# EasyEDA schematic SCH_Knov-V3_3-sound-+DMS13A_2026-08-17.json

## Sheets
1 Platine Bouton Sound +DMS13A: TITLE: COMMANDE G1000; REV: 3.45; Date: 2026-04-25; Sheet: 1/1; Drawn By: Obbiwan; Company: My Company
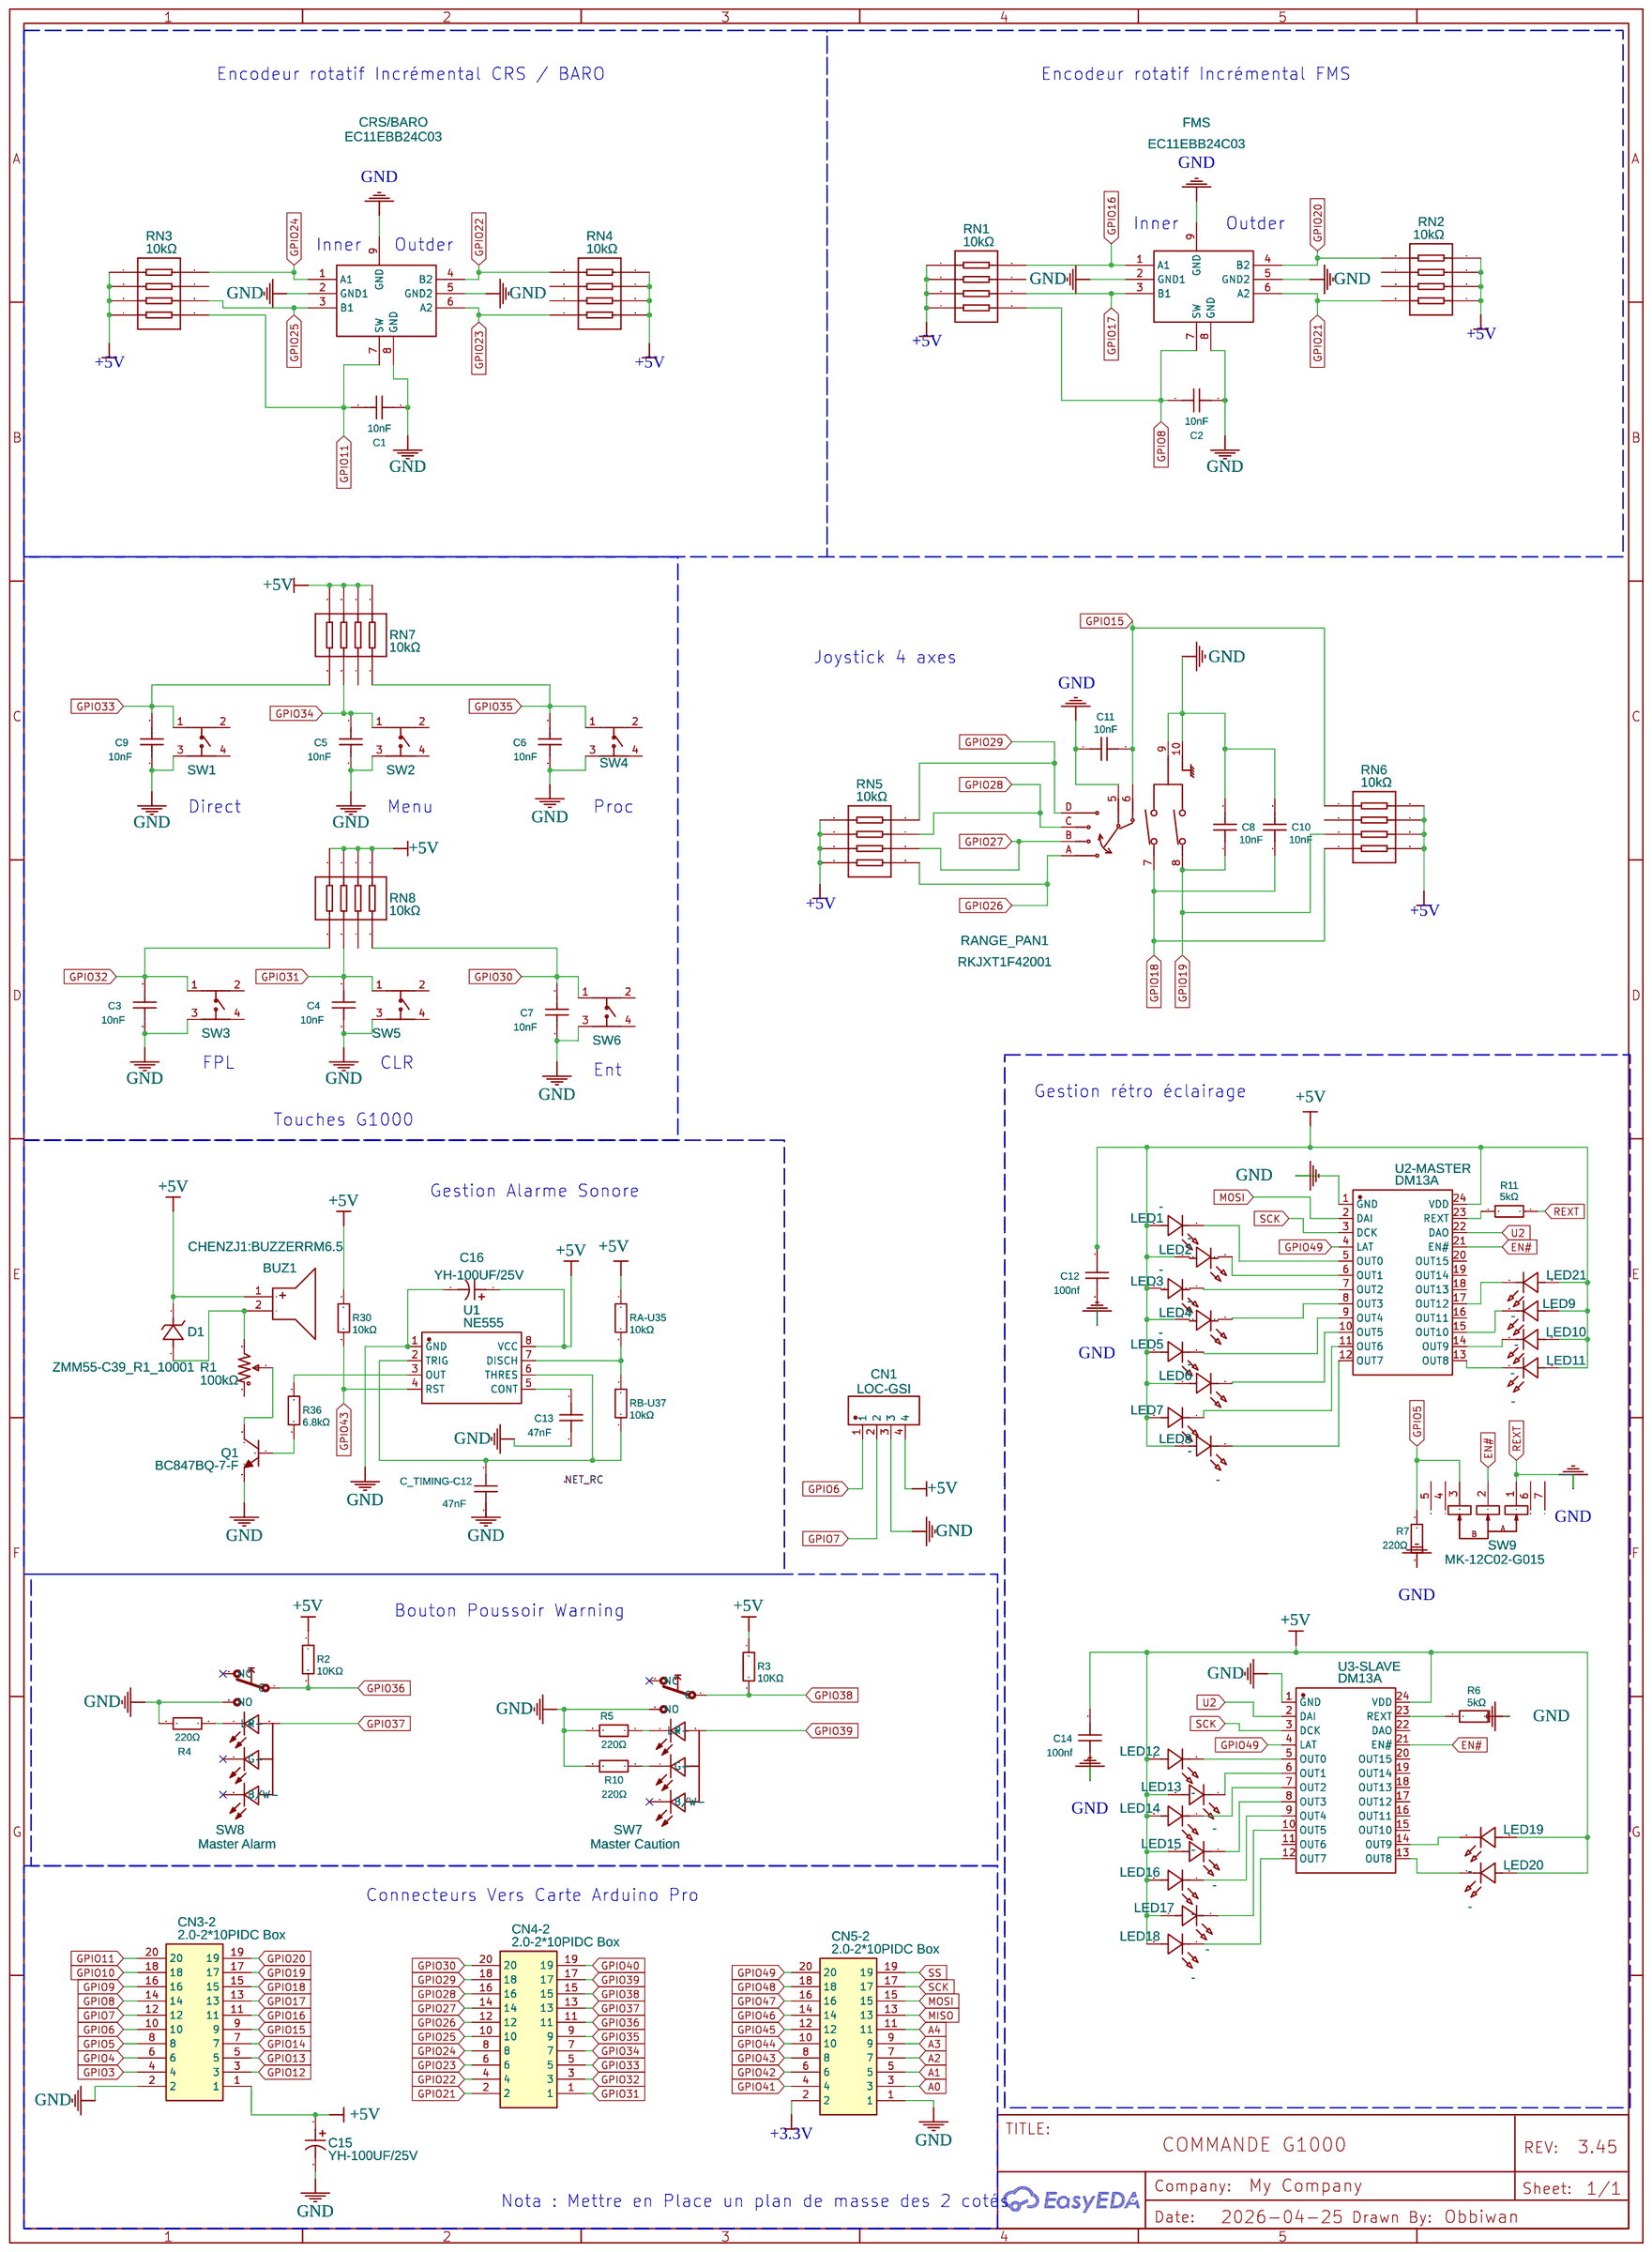
[diagram p0: Platine Bouton Sound +DMS13A]
2 Platine Arduino sound +DMS13A: TITLE: Platine G1000 - CPU; REV: 3.4; Date: 2025-11-30; Drawn By: francois.colas22; Company: Your Company
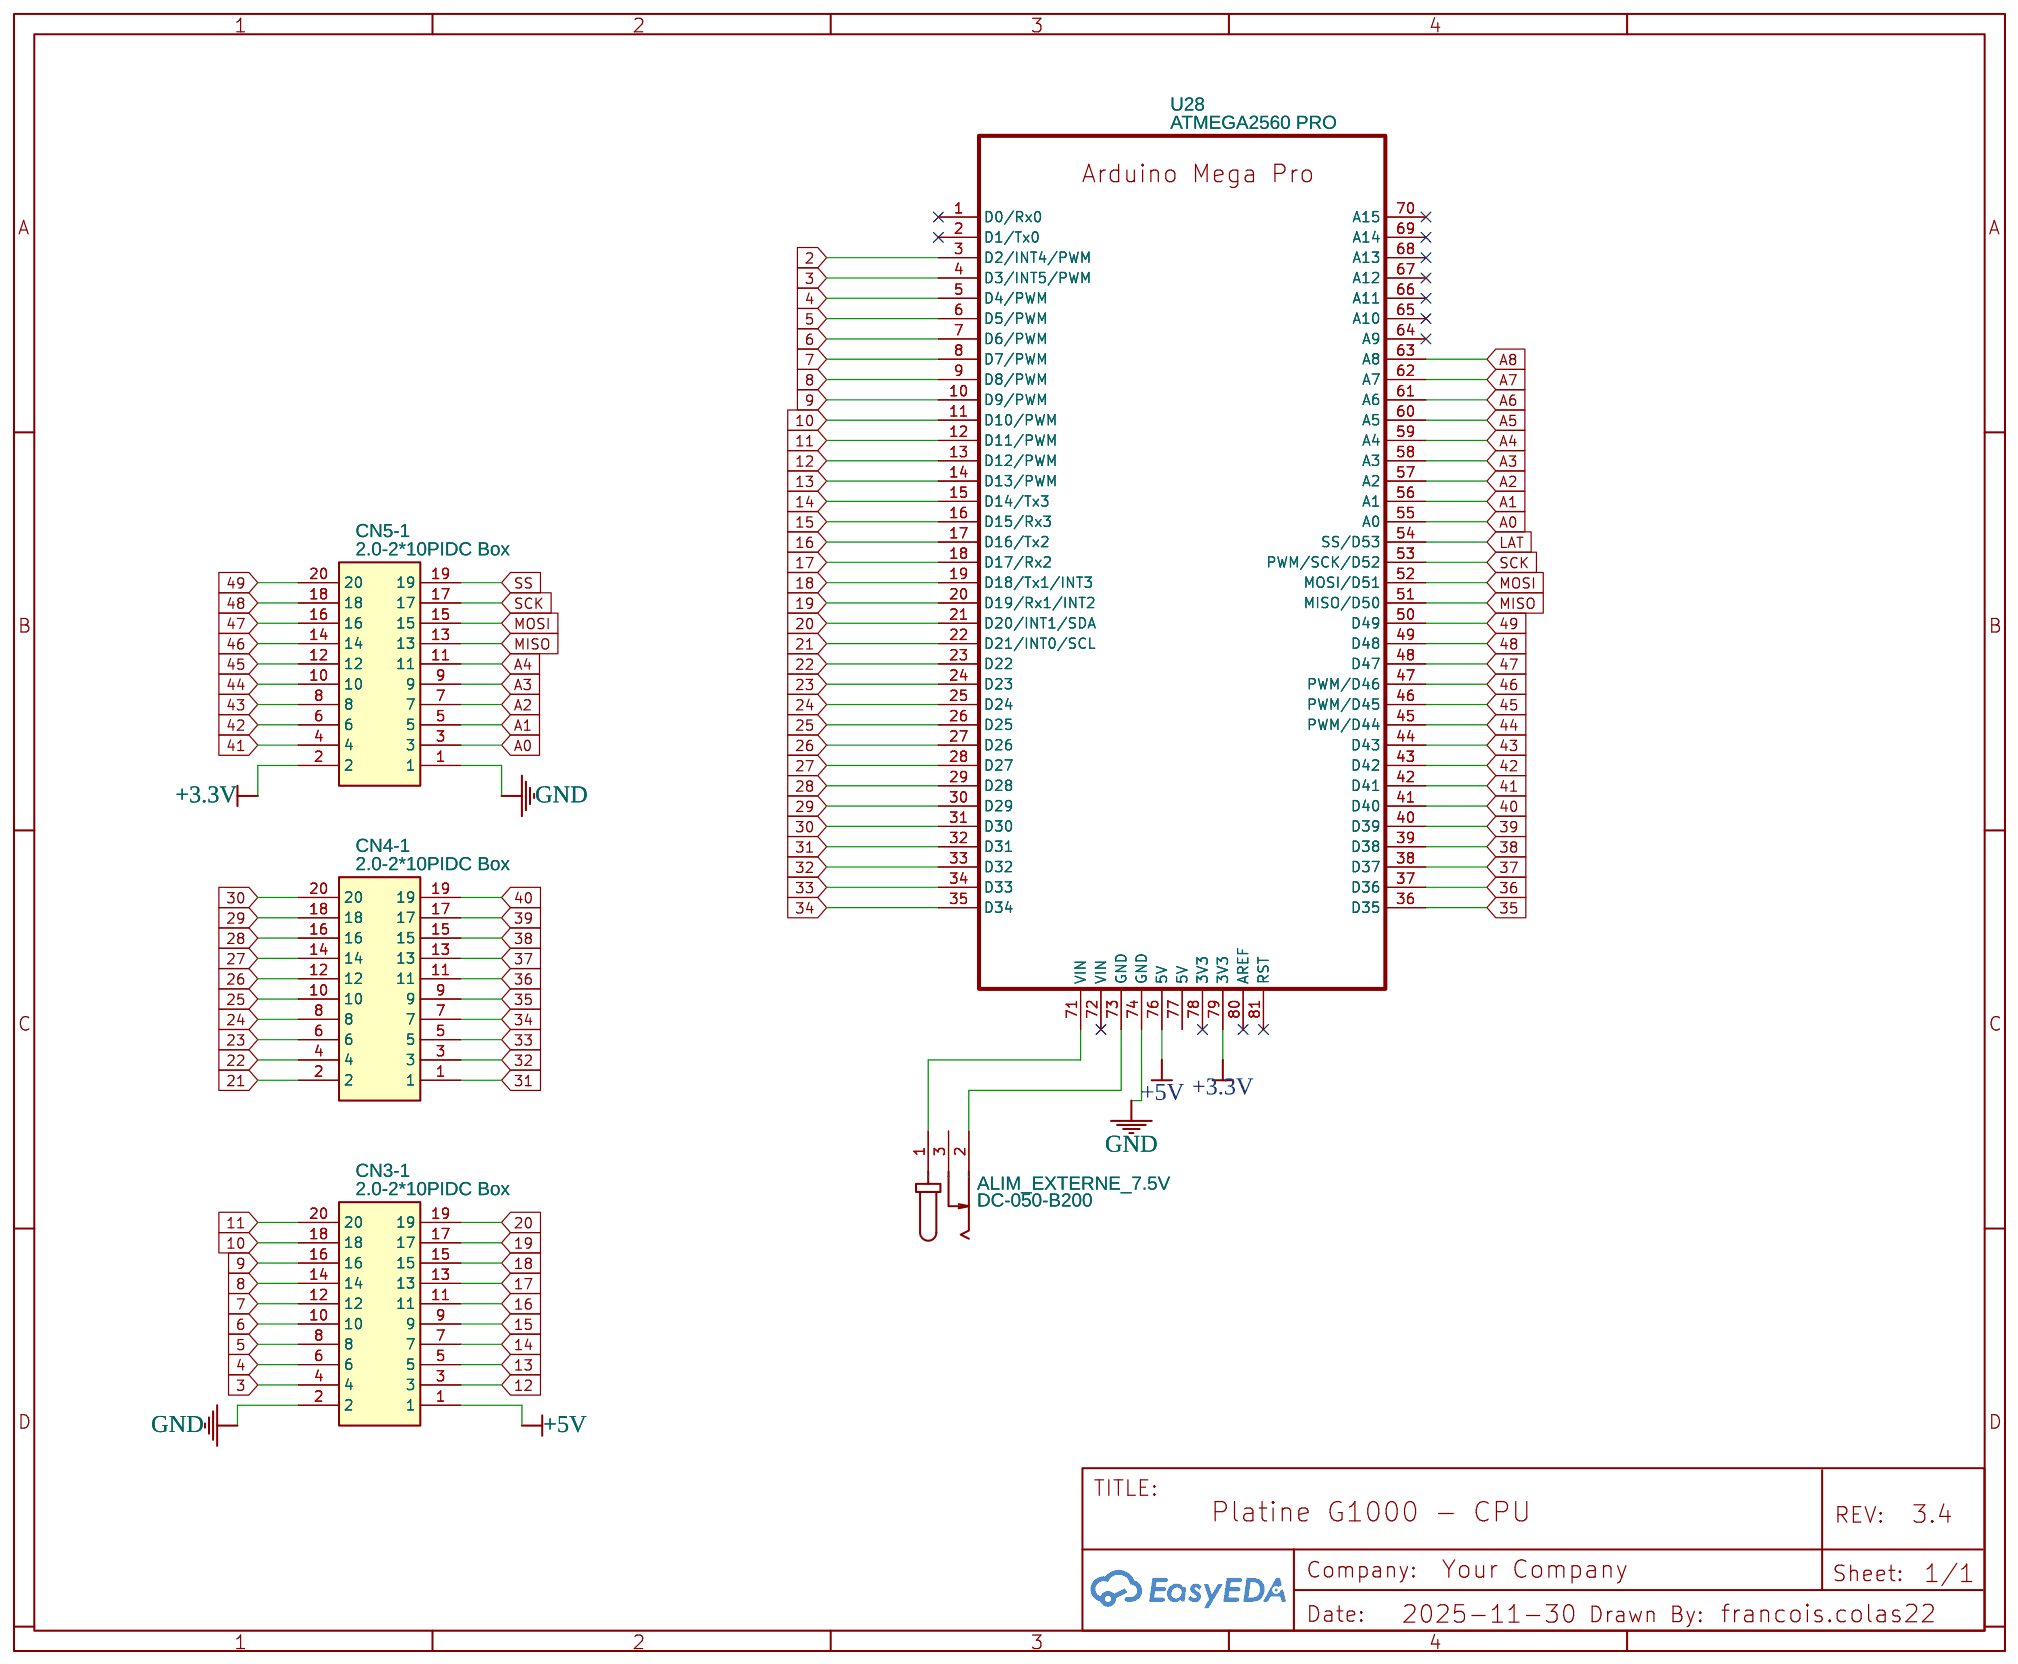
[diagram p1: Platine Arduino sound +DMS13A]
3 Platine LED: TITLE: Sheet_1; REV: 1.0; Date: 2026-05-24; Drawn By: francois.colas22; Company: Your Company
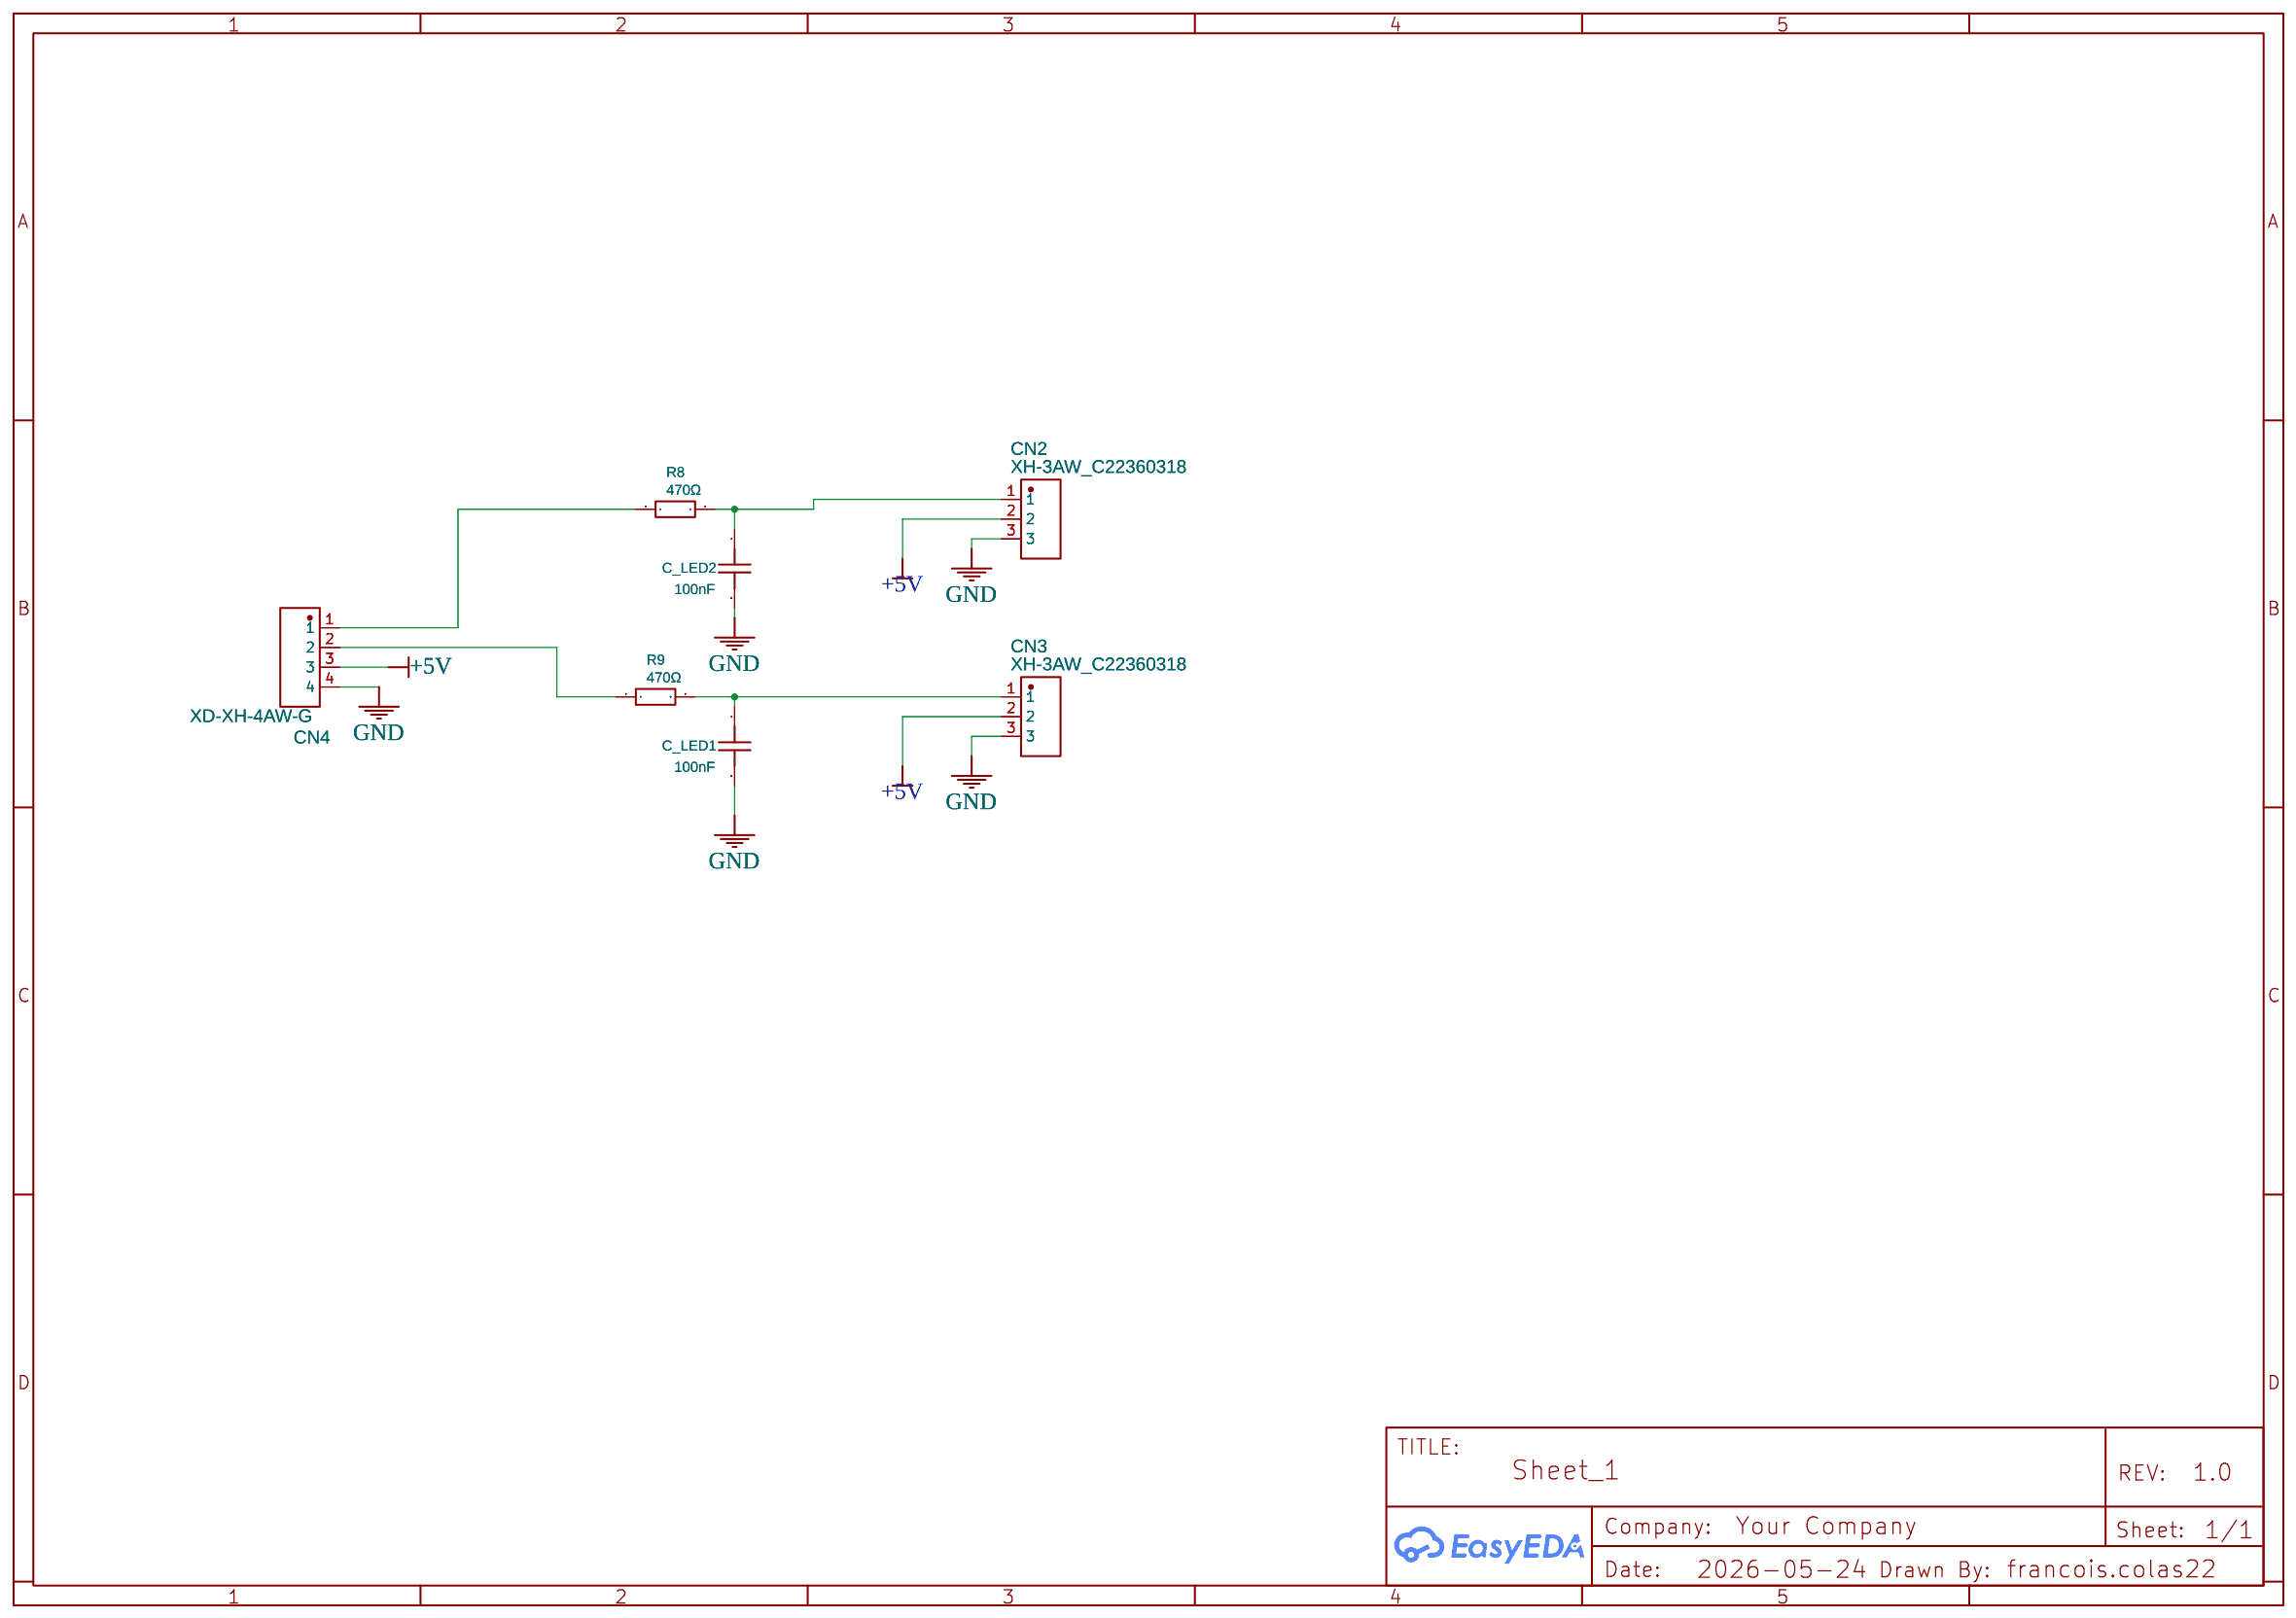
[diagram p2: Platine LED]

## Parts
sheet Platine Arduino sound +DMS13A
ALIM_EXTERNE_7.5V  DC-050-B200  [DC-IN-SMD_DC-050-B200]
CN3-1  2.0-2*10PIDC Box  [IDC-TH_2.0-2-10PIDCBOX]
CN4-1  2.0-2*10PIDC Box  [IDC-TH_2.0-2-10PIDCBOX]
CN5-1  2.0-2*10PIDC Box  [IDC-TH_2.0-2-10PIDCBOX]
U28  ATMEGA2560 PRO  [ATMEGA2560 EMBEDED]
sheet Platine Bouton Sound +DMS13A
BUZ1  CHENZJ1:BUZZERRM6.5  [BUZ-TH_BD12.0-P6.50-D0.6_SEA-1285F]
C1  10nF  [C0603]
C2  10nF  [C0603]
C3  10nF  [C0603]
C4  10nF  [C0603]
C5  10nF  [C0603]
C6  10nF  [C0603]
C7  10nF  [C0603]
C8  10nF  [C0603]
C9  10nF  [C0603]
C10  10nF  [C0603]
C11  10nF  [C0603]
C12  100nf  [C0603]
C13  47nF  [C0603]
C14  100nf  [C0603]
C15  YH-100UF/25V  [CAP-SMD_BD6.3-L6.6-W6.6-LS7.2-FD]
C16  YH-100UF/25V  [CAP-SMD_BD6.3-L6.6-W6.6-LS7.2-FD]
C_TIMING-C12  47nF  [C0603]
CN1  LOC-GSI  [CONN-TH_XD-XH-4AW-G]
CN3-2  2.0-2*10PIDC Box  [IDC-TH_2.0-2-10PIDCBOX]
CN4-2  2.0-2*10PIDC Box  [IDC-TH_2.0-2-10PIDCBOX]
CN5-2  2.0-2*10PIDC Box  [IDC-TH_2.0-2-10PIDCBOX]
CRS/BARO  EC11EBB24C03  [DUAL ENCODER W/CLICK EC11EBB24C03]
D1  ZMM55-C39_R1_10001  [LL-34_L3.5-W1.5-RD]
FMS  EC11EBB24C03  [DUAL ENCODER W/CLICK EC11EBB24C03]
LED1  -  [LED0805-RD_YELLOW]
LED2  -  [LED0805-RD_YELLOW]
LED3  -  [LED0805-RD_YELLOW]
LED4  -  [LED0805-RD_YELLOW]
LED5  -  [LED0805-RD_YELLOW]
LED6  -  [LED0805-RD_YELLOW]
LED7  -  [LED0805-RD_YELLOW]
LED8  -  [LED0805-RD_YELLOW]
LED9  -  [LED0805-RD_YELLOW]
LED10  -  [LED0805-RD_YELLOW]
LED11  -  [LED0805-RD_YELLOW]
LED12  -  [LED0805-RD_YELLOW]
LED13  -  [LED0805-RD_YELLOW]
LED14  -  [LED0805-RD_YELLOW]
LED15  -  [LED0805-RD_YELLOW]
LED16  -  [LED0805-RD_YELLOW]
LED17  -  [LED0805-RD_YELLOW]
LED18  -  [LED0805-RD_YELLOW]
LED19  -  [LED0805-RD_YELLOW]
LED20  -  [LED0805-RD_YELLOW]
LED21  -  [LED0805-RD_YELLOW]
Q1  BC847BQ-7-F  [SOT-23-3_L2.9-W1.3-P1.90-LS2.4-BR]
R1  100kΩ  [RES-ADJ-TH_3P-L7.3-W6.4-P5.00-R]
R2  10KΩ  [R0603]
R3  10KΩ  [R0603]
R4  220Ω  [R0603]
R5  220Ω  [R0603]
R6  5kΩ  [R0603]
R7  220Ω  [R0603]
R10  220Ω  [R0603]
R11  5kΩ  [R0603]
R30  10kΩ  [R0603]
R36  6.8kΩ  [R0603]
RA-U35  10kΩ  [R0603]
RANGE_PAN1  RKJXT1F42001  [SW-TH_RKJXT1F42001]
RB-U37  10kΩ  [R0603]
RN1  10kΩ  [RES-ARRAY-SMD_0603-8P-L3.2-W1.6-BL]
RN2  10kΩ  [RES-ARRAY-SMD_0603-8P-L3.2-W1.6-BL]
RN3  10kΩ  [RES-ARRAY-SMD_0603-8P-L3.2-W1.6-BL]
RN4  10kΩ  [RES-ARRAY-SMD_0603-8P-L3.2-W1.6-BL]
RN5  10kΩ  [RES-ARRAY-SMD_0603-8P-L3.2-W1.6-BL]
RN6  10kΩ  [RES-ARRAY-SMD_0603-8P-L3.2-W1.6-BL]
RN7  10kΩ  [RES-ARRAY-SMD_0603-8P-L3.2-W1.6-BL]
RN8  10kΩ  [RES-ARRAY-SMD_0603-8P-L3.2-W1.6-BL]
SW1  YTS-D001-285  [SW-TH_4P-L6.0-W6.0-P4.50-LS6.5]
SW2  YTS-D001-285  [SW-TH_4P-L6.0-W6.0-P4.50-LS6.5]
SW3  YTS-D001-285  [SW-TH_4P-L6.0-W6.0-P4.50-LS6.5]
SW4  YTS-D001-285  [SW-TH_4P-L6.0-W6.0-P4.50-LS6.5]
SW5  YTS-D001-285  [SW-TH_4P-L6.0-W6.0-P4.50-LS6.5]
SW6  YTS-D001-285  [SW-TH_4P-L6.0-W6.0-P4.50-LS6.5]
SW7  Master Caution  [PB26-13M RGB/W-LED]
SW8  Master Alarm  [PB26-13M RGB/W-LED]
SW9  MK-12C02-G015  [SW-SMD_G-SWITCH_MK-12C02-G015]
U1  NE555  [SOIC-8_L4.9-W3.9-P1.27-LS6.0-BL]
U2-MASTER  DM13A  [SOP-24_L13.0-W6.0-P1.00-LS8.0-BL]
U3-SLAVE  DM13A  [SOP-24_L13.0-W6.0-P1.00-LS8.0-BL]
sheet Platine LED
C_LED1  100nF  [C0603]
C_LED2  100nF  [C0603]
CN2  XH-3AW_C22360318  [CONN-TH_XH-3AW]
CN3  XH-3AW_C22360318  [CONN-TH_XH-3AW]
CN4  XD-XH-4AW-G  [CONN-TH_XD-XH-4AW-G]
R8  470Ω  [R0603]
R9  470Ω  [R0603]

## Library data of the parts
ALIM_EXTERNE_7.5V = DC-050-B200: Contributor: lcsc; Supplier: LCSC; Supplier Part: C720582; Manufacturer: XUNPU(讯普); JLCPCB Part Class: Extended Part
CN3-1 CN3-2 CN4-1 CN4-2 CN5-1 CN5-2 = 2.0-2*10PIDC Box: Supplier: LCSC; Manufacturer: BOOMELE; Supplier Part: C55267; JLCPCB Part Class: Extended Part; Contributor: Bijesh Manayil
U28 = ATMEGA2560 PRO: Manufacturer: RobotDyn; Manufacturer Part: MEGA-PRO-CH340G/ATmega2560; Contributor: hindsight
BUZ1 = CHENZJ1:BUZZER_12X9.5RM6.5: Contributor: LCSC; Supplier: LCSC; Supplier Part: C9900008742; Manufacturer: null; Manufacturer Part: chenzj1:Buzzer_12x9.5RM6.5; JLCPCB Part Class: Extended Part
C1-C14 C_LED1 C_LED2 C_TIMING-C12 = CT41G-0603-2X1-50V-0.01UF-K(N): Contributor: LCSC; Supplier: LCSC; Supplier Part: C136131; Manufacturer: TORCH(火炬); Manufacturer Part: CT41G-0603-2X1-50V-0.01μF-K(N); JLCPCB Part Class: Extended Part; link: https://lcsc.com/eda_search?q=C136131&%26type=1&ref=editor
C15 C16 = YH-100UF/25V-贴片电解电容: Contributor: LCSC; Supplier: LCSC; Supplier Part: C9900006374; Manufacturer Part: YH-100uF/25V-贴片电解电容; JLCPCB Part Class: Extended Part; Manufacturer: null
CN1 CN4 = XD-XH-4AW-G: Supplier: LCSC; Supplier Part: C17700963; Manufacturer: XUNDA(讯答); JLCPCB Part Class: Extended Part; Contributor: lcsc
CRS/BARO FMS = EC11EBB24C03: Contributor: Xavi Jurio; link: https://www.alps.com/prod/info/E/HTML/Encoder/Incremental/EC11/EC11EBB24C03.html
D1 = ZMM55-C39_R1_10001: Contributor: LCSC; Supplier: LCSC; Supplier Part: C391779; Manufacturer: PANJIT(强茂); JLCPCB Part Class: Extended Part
LED1-LED21 = TZ-P2-0805YTCS2-0.8T: Contributor: LCSC; Supplier: LCSC; Supplier Part: C20608785; Manufacturer: LITEON(光宝); Manufacturer Part: YLED0805Y; JLCPCB Part Class: Extended Part
Q1 = BC847BQ-7-F: Contributor: lcsc; Supplier: LCSC; Supplier Part: C2922347; Manufacturer: DIODES(美台); JLCPCB Part Class: Extended Part
R1 = RM065-204(200K): Contributor: lcsc; Supplier: LCSC; Supplier Part: C5205025; Manufacturer: BOCHEN(博晨); JLCPCB Part Class: Extended Part
R2 R30 = HPCR0603F5K60K9: Supplier: LCSC; Supplier Part: C365194; Manufacturer: RESI(开步睿思）; Manufacturer Part: SCR0603J10K; Resistance (Ohms): 10K; Contributor: LCSC; JLCPCB Part Class: Extended Part
R3 R7-R9 R36 = HPCR0603F5K60K9: Supplier: LCSC; Supplier Part: C365194; Manufacturer: RESI(开步睿思）; Manufacturer Part: SCR0603J10K; Resistance (Ohms): 10kΩ; Contributor: LCSC; JLCPCB Part Class: Extended Part
R4 R5 R10 = HPCR0603F5K60K9: Supplier: LCSC; Supplier Part: C365194; Manufacturer: RESI(开步睿思）; Contributor: LCSC; JLCPCB Part Class: Extended Part
R6 R11 = HPCR0603F5K60K9: Supplier: LCSC; Supplier Part: C365194; Manufacturer: RESI(开步睿思）; Resistance (Ohms): 36Ω; Contributor: LCSC; JLCPCB Part Class: Extended Part
RA-U35 RB-U37 = HPCR0603F5K60K9: Supplier: LCSC; Supplier Part: C365194; Manufacturer: RESI(开步睿思）; Manufacturer Part: SCR0603J10K; Contributor: LCSC; JLCPCB Part Class: Extended Part
RANGE_PAN1 = RKJXT1F42001: Supplier: LCSC; Supplier Part: C160841; Manufacturer: ALPSALPINE(阿尔卑斯阿尔派); Contributor: LCSC; JLCPCB Part Class: Extended Part
RN1-RN8 = RTA03-4D103JTP: Supplier: LCSC; Manufacturer: RALEC(旺诠); Supplier Part: C102646; JLCPCB Part Class: Extended Part
SW1-SW6 = YTS-D001-285: Contributor: LCSC; Supplier: LCSC; Supplier Part: C2910911; Manufacturer: YIYUAN(怡远); JLCPCB Part Class: Extended Part; link: https://lcsc.com/eda_search?q=C2910911&%26type=1&ref=editor
SW7 SW8 = PB26-13M RGB/W: Manufacturer: Honyone; Contributor: Tony Sloos
SW9 = MK-12C02-G015: Contributor: LCSC; Supplier: LCSC; Supplier Part: C2911519; Manufacturer: G-Switch(品赞); JLCPCB Part Class: Extended Part
U1 = NE555DR_C41431778: Supplier: LCSC; Supplier Part: C41431778; Manufacturer: TECH PUBLIC(台舟); Manufacturer Part: NE555DR; Contributor: lcsc; JLCPCB Part Class: Extended Part; Package Display: No
U2-MASTER U3-SLAVE = DM13A: Contributor: lcsc; Supplier: LCSC; Supplier Part: C9900020811; Manufacturer: null; JLCPCB Part Class: Extended Part
CN2 CN3 = XH-3AW_C22360318: Supplier: LCSC; Supplier Part: C22360318; Manufacturer: 韩国韩荣; Manufacturer Part: XH-3AW; JLCPCB Part Class: Extended Part; Contributor: lcsc

## Nets
+3.3V: CN5-1.2 CN5-2.2 U28.79(3V3)
+5V: BUZ1.1(+) C12.1 C14.1 C15.1 C16.1 CN1.4 CN2.2 CN3.2 CN3-1.1 CN3-2.1 CN4.3 D1.1(K) LED1.2(A) LED2.2(A) LED3.2(A) LED4.2(A) LED5.2(A) LED6.2(A) LED7.2(A) LED8.2(A) LED9.2(A) LED10.2(A) LED11.2(A) LED12.2(A) LED13.2(A) LED14.2(A) LED15.2(A) LED16.2(A) LED17.2(A) LED18.2(A) LED19.2(A) LED20.2(A) LED21.2(A) R2.1 R3.1 R30.1 RA-U35.1 RN1.1 RN1.2 RN1.3 RN1.4 RN2.1 RN2.2 RN2.3 RN2.4 RN3.1 RN3.2 RN3.3 RN3.4 RN4.5 RN4.6 RN4.7 RN4.8 RN5.1 RN5.2 RN5.3 RN5.4 RN6.5 RN6.6 RN6.7 RN6.8 RN7.1 RN7.2 RN7.3 RN7.4 RN8.1 RN8.2 RN8.3 RN8.4 U1.8(VCC) U2-MASTER.24(VDD) U3-SLAVE.24(VDD) U28.76(5V)
GND: C1.2 C2.2 C3.2 C4.2 C5.2 C6.2 C7.2 C8.2 C9.2 C10.2 C11.1 C12.2 C13.2 C14.2 C15.2 C16.2 C_LED1.2 C_LED2.2 C_TIMING-C12.2 CN1.3 CN2.3 CN3.3 CN3-1.2 CN3-2.2 CN4.4 CN5-1.1 CN5-2.1 CRS/BARO.2(GND1) CRS/BARO.5(GND2) CRS/BARO.8(GND) CRS/BARO.9(GND) FMS.2(GND1) FMS.5(GND2) FMS.8(GND) FMS.9(GND) Q1.2(E) R4.2 R5.2 R6.1 R7.2 R10.2 R11.1 RANGE_PAN1.5(PUSH) RANGE_PAN1.9(E_C) RANGE_PAN1.10 SW1.3 SW2.3 SW3.3 SW4.3 SW5.3 SW6.3 SW7.2(NO) SW8.2(NO) SW9.1 U1.1(GND) U2-MASTER.1(GND) U3-SLAVE.1(GND) U28.74(GND)
2: U28.3(D2/INT4/PWM)
3: CN3-1.4 U28.4(D3/INT5/PWM)
4: CN3-1.6 U28.5(D4/PWM)
5: CN3-1.8 U28.6(D5/PWM)
6: CN3-1.10 U28.7(D6/PWM)
7: CN3-1.12 U28.8(D7/PWM)
8: CN3-1.14 U28.9(D8/PWM)
9: CN3-1.16 U28.10(D9/PWM)
10: CN3-1.18 U28.11(D10/PWM)
11: CN3-1.20 U28.12(D11/PWM)
12: CN3-1.3 U28.13(D12/PWM)
13: CN3-1.5 U28.14(D13/PWM)
14: CN3-1.7 U28.15(D14/Tx3)
15: CN3-1.9 U28.16(D15/Rx3)
16: CN3-1.11 U28.17(D16/Tx2)
17: CN3-1.13 U28.18(D17/Rx2)
18: CN3-1.15 U28.19(D18/Tx1/INT3)
19: CN3-1.17 U28.20(D19/Rx1/INT2)
20: CN3-1.19 U28.21(D20/INT1/SDA)
21: CN4-1.2 U28.22(D21/INT0/SCL)
22: CN4-1.4 U28.23(D22)
23: CN4-1.6 U28.24(D23)
24: CN4-1.8 U28.25(D24)
25: CN4-1.10 U28.26(D25)
26: CN4-1.12 U28.27(D26)
27: CN4-1.14 U28.28(D27)
28: CN4-1.16 U28.29(D28)
29: CN4-1.18 U28.30(D29)
30: CN4-1.20 U28.31(D30)
31: CN4-1.1 U28.32(D31)
32: CN4-1.3 U28.33(D32)
33: CN4-1.5 U28.34(D33)
34: CN4-1.7 U28.35(D34)
35: CN4-1.9 U28.36(D35)
36: CN4-1.11 U28.37(D36)
37: CN4-1.13 U28.38(D37)
38: CN4-1.15 U28.39(D38)
39: CN4-1.17 U28.40(D39)
40: CN4-1.19 U28.41(D40)
41: CN5-1.4 U28.42(D41)
42: CN5-1.6 U28.43(D42)
43: CN5-1.8 U28.44(D43)
44: CN5-1.10 U28.45(PWM/D44)
45: CN5-1.12 U28.46(PWM/D45)
46: CN5-1.14 U28.47(PWM/D46)
47: CN5-1.16 U28.48(D47)
48: CN5-1.18 U28.49(D48)
49: CN5-1.20 U28.50(D49)
A0: CN5-1.3 CN5-2.3 U28.55(A0)
A1: CN5-1.5 CN5-2.5 U28.56(A1)
A2: CN5-1.7 CN5-2.7 U28.57(A2)
A3: CN5-1.9 CN5-2.9 U28.58(A3)
A4: CN5-1.11 CN5-2.11 U28.59(A4)
A5: U28.60(A5)
A6: U28.61(A6)
A7: U28.62(A7)
A8: U28.63(A8)
EN#: SW9.2 U2-MASTER.21(EN#) U3-SLAVE.21(EN#)
GPIO3: CN3-2.4
GPIO4: CN3-2.6
GPIO5: CN3-2.8 R7.1 SW9.3
GPIO6: CN1.1 CN3-2.10
GPIO7: CN1.2 CN3-2.12
GPIO8: C2.1 CN3-2.14 FMS.7(SW) RN1.5
GPIO9: CN3-2.16
GPIO10: CN3-2.18
GPIO11: C1.1 CN3-2.20 CRS/BARO.7(SW) RN3.5
GPIO12: CN3-2.3
GPIO13: CN3-2.5
GPIO14: CN3-2.7
GPIO15: C11.2 CN3-2.9 RANGE_PAN1.6(COM) RN6.1
GPIO16: CN3-2.11 FMS.1(A1) RN1.8
GPIO17: CN3-2.13 FMS.3(B1) RN1.6
GPIO18: C10.1 CN3-2.15 RANGE_PAN1.7(E_B) RN6.4
GPIO19: C8.1 CN3-2.17 RANGE_PAN1.8(E_A) RN6.3
GPIO20: CN3-2.19 FMS.4(B2) RN2.8
GPIO21: CN4-2.2 FMS.6(A2) RN2.5
GPIO22: CN4-2.4 CRS/BARO.4(B2) RN4.1
GPIO23: CN4-2.6 CRS/BARO.6(A2) RN4.4
GPIO24: CN4-2.8 CRS/BARO.1(A1) RN3.8
GPIO25: CN4-2.10 CRS/BARO.3(B1) RN3.6
GPIO26: CN4-2.12 RANGE_PAN1.A RN5.5
GPIO27: CN4-2.14 RANGE_PAN1.B RN5.6
GPIO28: CN4-2.16 RANGE_PAN1.C RN5.7
GPIO29: CN4-2.18 RANGE_PAN1.D RN5.8
GPIO30: C7.1 CN4-2.20 RN8.8 SW6.1
GPIO31: C4.1 CN4-2.1 RN8.6 SW5.1
GPIO32: C3.1 CN4-2.3 RN8.5 SW3.1
GPIO33: C9.1 CN4-2.5 RN7.5 SW1.1
GPIO34: C5.1 CN4-2.7 RN7.6 SW2.1
GPIO35: C6.1 CN4-2.9 RN7.8 SW4.1
GPIO36: CN4-2.11 R2.2 SW8.1(C)
GPIO37: CN4-2.13 SW8.5(L+)
GPIO38: CN4-2.15 R3.2 SW7.1(C)
GPIO39: CN4-2.17 SW7.5(L+)
GPIO40: CN4-2.19
GPIO41: CN5-2.4
GPIO42: CN5-2.6
GPIO43: CN5-2.8 R30.2 U1.4(RST)
GPIO44: CN5-2.10
GPIO45: CN5-2.12
GPIO46: CN5-2.14
GPIO47: CN5-2.16
GPIO48: CN5-2.18
GPIO49: CN5-2.20 U2-MASTER.4(LAT) U3-SLAVE.4(LAT)
LAT: U28.54(SS/D53)
MISO: CN5-1.13 CN5-2.13 U28.51(MISO/D50)
MOSI: CN5-1.15 CN5-2.15 U2-MASTER.2(DAI) U28.52(MOSI/D51)
SCK: CN5-1.17 CN5-2.17 U2-MASTER.3(DCK) U3-SLAVE.3(DCK) U28.53(PWM/SCK/D52)
SS: CN5-1.19 CN5-2.19
U2: U2-MASTER.22(DAO) U3-SLAVE.2(DAI)
Net-(ALIM_EXTERNE_7.5V-1): ALIM_EXTERNE_7.5V.1 U28.71(VIN)
Net-(ALIM_EXTERNE_7.5V-2): ALIM_EXTERNE_7.5V.2 U28.73(GND)
Net-(BUZ1-2): BUZ1.2(-) D1.2(A) R1.3
Net-(C13-1): C13.1 U1.5(CONT)
Net-(C_LED1-1): C_LED1.1 CN3.1 R9.2
Net-(C_LED2-1): C_LED2.1 CN2.1 R8.2
Net-(C_TIMING-C12-1): C_TIMING-C12.1 RB-U37.2 U1.2(TRIG) U1.6(THRES)
Net-(CN4-1): CN4.1 R8.1
Net-(CN4-2): CN4.2 R9.1
Net-(LED1-1): LED1.1(K) U2-MASTER.5(OUT0)
Net-(LED2-1): LED2.1(K) U2-MASTER.6(OUT1)
Net-(LED3-1): LED3.1(K) U2-MASTER.7(OUT2)
Net-(LED4-1): LED4.1(K) U2-MASTER.8(OUT3)
Net-(LED5-1): LED5.1(K) U2-MASTER.9(OUT4)
Net-(LED6-1): LED6.1(K) U2-MASTER.10(OUT5)
Net-(LED7-1): LED7.1(K) U2-MASTER.11(OUT6)
Net-(LED8-1): LED8.1(K) U2-MASTER.12(OUT7)
Net-(LED9-1): LED9.1(K) U2-MASTER.15(OUT10)
Net-(LED10-1): LED10.1(K) U2-MASTER.14(OUT9)
Net-(LED11-1): LED11.1(K) U2-MASTER.13(OUT8)
Net-(LED12-1): LED12.1(K) U3-SLAVE.5(OUT0)
Net-(LED13-1): LED13.1(K) U3-SLAVE.6(OUT1)
Net-(LED14-1): LED14.1(K) U3-SLAVE.7(OUT2)
Net-(LED15-1): LED15.1(K) U3-SLAVE.8(OUT3)
Net-(LED16-1): LED16.1(K) U3-SLAVE.9(OUT4)
Net-(LED17-1): LED17.1(K) U3-SLAVE.10(OUT5)
Net-(LED18-1): LED18.1(K) U3-SLAVE.12(OUT7)
Net-(LED19-1): LED19.1(K) U3-SLAVE.14(OUT9)
Net-(LED20-1): LED20.1(K) U3-SLAVE.13(OUT8)
Net-(LED21-1): LED21.1(K) U2-MASTER.17(OUT12)
Net-(Q1-1): Q1.1(B) R36.1
Net-(Q1-3): Q1.3(C) R1.2
Net-(R4-1): R4.1 SW8.4(R-)
Net-(R5-1): R5.1 SW7.4(R-)
Net-(R6-2): R6.2 U3-SLAVE.23(REXT)
Net-(R10-1): R10.1 SW7.7(G-)
Net-(R11-2): R11.2 U2-MASTER.23(REXT)
Net-(R36-2): R36.2 U1.3(OUT)
Net-(RA-U35-2): RA-U35.2 RB-U37.1 U1.7(DISCH)

Not connected (* = marked no-connect by the designer): ALIM_EXTERNE_7.5V 3; R1 1; RN1 7; RN2 6 7; RN3 7; RN4 2 3; RN6 2; RN7 7; RN8 7; SW1 2 4; SW2 2 4; SW3 2 4; SW4 2 4; SW5 2 4; SW6 2 4; SW7 3(NC)* 6(B/W-)*; SW8 3(NC)* 6(B/W-)* 7(G-)*; SW9 4 5 6 7; U2-MASTER 16(OUT11) 18(OUT13) 19(OUT14) 20(OUT15); U3-SLAVE 11(OUT6) 15(OUT10) 16(OUT11) 17(OUT12) 18(OUT13) 19(OUT14) 20(OUT15) 22(DAO); U28 1(D0/Rx0)* 2(D1/Tx0)* 64(A9)* 65(A10)* 66(A11)* 67(A12)* 68(A13)* 69(A14)* 70(A15)* 72(VIN)* 77(5V) 78(3V3)* 80(AREF)* 81(RST)*

## Notes on the sheets
sheet 1
- Encodeur rotatif Incrémental CRS / BARO
- Encodeur rotatif Incrémental FMS
- Inner
- Outder
- Inner
- Outder
- Joystick 4 axes
- Direct
- Menu
- Proc
- FPL
- CLR
- Ent
- Gestion rétro éclairage
- Touches G1000
- Gestion Alarme Sonore
- Bouton Poussoir Warning
- Connecteurs Vers Carte Arduino Pro
- Nota : Mettre en Place un plan de masse des 2 cotés
